# Altium schematic sheet AVR64DA64-IO.SchDoc
size A4; SheetNumber: 2; SheetTotal: 3
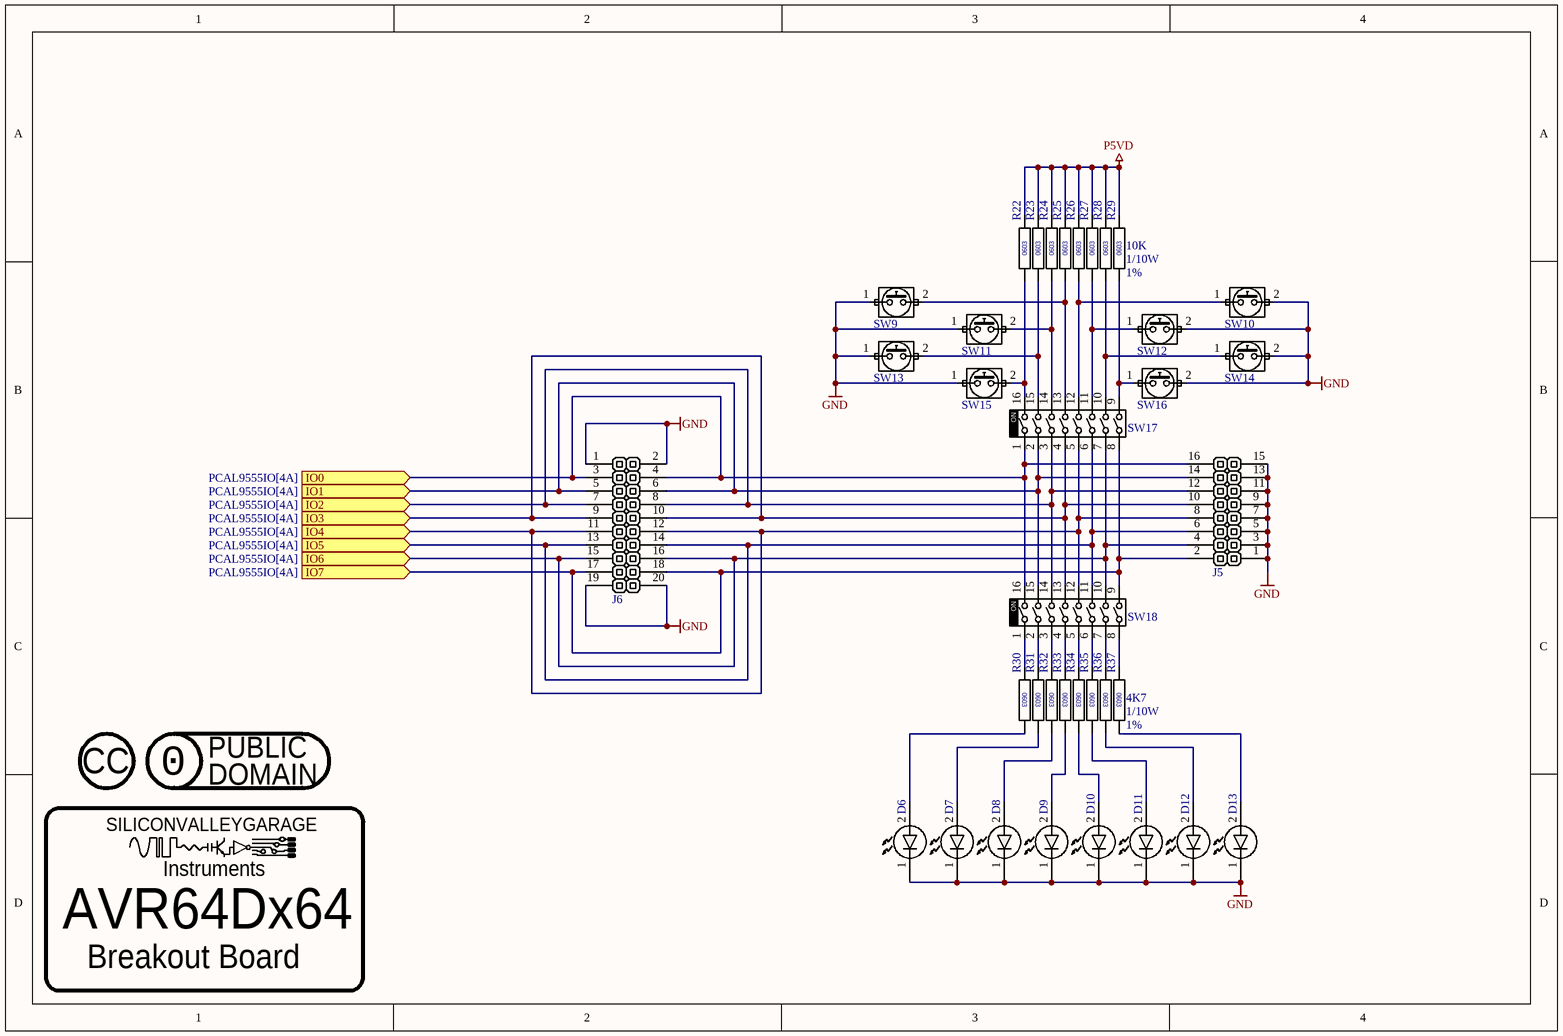
[diagram p0: AVR64DA64-IO.SchDoc]

## Parts
(Parts that share a designator on the sheet are numbered #1, #2 ... from top to bottom, then left to right.)
D6  KT-0603W  [LED-0603-GREEN]  (value not drawn)
D7  KT-0603W  [LED-0603-GREEN]  (value not drawn)
D8  KT-0603W  [LED-0603-GREEN]  (value not drawn)
D9  KT-0603W  [LED-0603-GREEN]  (value not drawn)
D10  KT-0603W  [LED-0603-GREEN]  (value not drawn)
D11  KT-0603W  [LED-0603-GREEN]  (value not drawn)
D12  KT-0603W  [LED-0603-GREEN]  (value not drawn)
D13  KT-0603W  [LED-0603-GREEN]  (value not drawn)
J5  BOXHEADER-3X2  [CONNECTOR-GENERIC-PINHEADER-2X8]  (value not drawn)
J6  BOXHEADER-3X2  [CONNECTOR-GENERIC-PINHEADER-2X10]  (value not drawn)
LOGO?#1  LOGO-LICENSE-CC  [LOGO-LICENSE-CC]  (value not drawn)  (no BOM)
LOGO?#2  LOGO-LICENSE-CC0-PUBLIC  [LOGO-LICENSE-CC0-PUBLIC]  (value not drawn)  (no BOM)
LOGO?#3  LOGO-SILICONVALLEYGARAGE-SMALL  [SILICONVALLEYGARAGE]  (value not drawn)  (graphical)
R22  RESC0603  [RESC0603]  (value not drawn)
R23  RESC0603  [RESC0603]  (value not drawn)
R24  RESC0603  [RESC0603]  (value not drawn)
R25  RESC0603  [RESC0603]  (value not drawn)
R26  RESC0603  [RESC0603]  (value not drawn)
R27  RESC0603  [RESC0603]  (value not drawn)
R28  RESC0603  [RESC0603]  (value not drawn)
R29  value 10K  Power: 1/10W  Tolerance: 1%  [RESC0603]  (hidden comment: RESC0603)
R30  RESC0603  [RESC0603]  (value not drawn)
R31  RESC0603  [RESC0603]  (value not drawn)
R32  RESC0603  [RESC0603]  (value not drawn)
R33  RESC0603  [RESC0603]  (value not drawn)
R34  RESC0603  [RESC0603]  (value not drawn)
R35  RESC0603  [RESC0603]  (value not drawn)
R36  RESC0603  [RESC0603]  (value not drawn)
R37  value 4K7  Power: 1/10W  Tolerance: 1%  [RESC0603]  (hidden comment: RESC0603)
SW9  SWITCH-XUNPU-TS-1088-AR02016  [SWITCH-XUNPU-TS-1088-AR02016]  (value not drawn)
SW10  SWITCH-XUNPU-TS-1088-AR02016  [SWITCH-XUNPU-TS-1088-AR02016]  (value not drawn)
SW11  SWITCH-XUNPU-TS-1088-AR02016  [SWITCH-XUNPU-TS-1088-AR02016]  (value not drawn)
SW12  SWITCH-XUNPU-TS-1088-AR02016  [SWITCH-XUNPU-TS-1088-AR02016]  (value not drawn)
SW13  SWITCH-XUNPU-TS-1088-AR02016  [SWITCH-XUNPU-TS-1088-AR02016]  (value not drawn)
SW14  SWITCH-XUNPU-TS-1088-AR02016  [SWITCH-XUNPU-TS-1088-AR02016]  (value not drawn)
SW15  SWITCH-XUNPU-TS-1088-AR02016  [SWITCH-XUNPU-TS-1088-AR02016]  (value not drawn)
SW16  SWITCH-XUNPU-TS-1088-AR02016  [SWITCH-XUNPU-TS-1088-AR02016]  (value not drawn)
SW17  SWITCH-DIP-NOX8-SMT-2.54  [SWITCH-CTS-219-8MST]  (value not drawn)
SW18  SWITCH-DIP-NOX8-SMT-2.54  [SWITCH-CTS-219-8MST]  (value not drawn)

## Blocks framed on the sheet
AVR64Dx64: LOGO?#3

## Ports
IO0 (in, see PCAL9555IO[4A]), IO1 (in, see PCAL9555IO[4A]), IO2 (in, see PCAL9555IO[4A]), IO3 (in, see PCAL9555IO[4A]), IO4 (in, see PCAL9555IO[4A]), IO5 (in, see PCAL9555IO[4A]), IO6 (in, see PCAL9555IO[4A]), IO7 (in, see PCAL9555IO[4A])

## Nets
GND: D6.1(A) D7.1(A) D8.1(A) D9.1(A) D10.1(A) D11.1(A) D12.1(A) D13.1(A) J5.1(+) J5.3(-) J5.5(-) J5.7(-) J5.9(-) J5.11(-) J5.13(-) J5.15(-) J6.1(+) J6.2(-) J6.19(-) J6.20(-) SW9.1 SW10.2 SW11.1 SW12.2 SW13.1 SW14.2 SW15.1 SW16.2
P5VD: R22.1 R23.1 R24.1 R25.1 R26.1 R27.1 R28.1 R29.1
IO0: J5.16(-) J6.3(-) J6.4(-) SW17.1 SW18.16 ; port IO0
IO1: J5.14(-) J6.5(-) J6.6(-) SW17.2 SW18.15 ; port IO1
IO2: J5.12(-) J6.7(-) J6.8(-) SW17.3 SW18.14 ; port IO2
IO3: J5.10(-) J6.9(-) J6.10(-) SW17.4 SW18.13 ; port IO3
IO4: J5.8(-) J6.11(-) J6.12(-) SW17.5 SW18.12 ; port IO4
IO5: J5.6(-) J6.13(-) J6.14(-) SW17.6 SW18.11 ; port IO5
IO6: J5.4(-) J6.15(-) J6.16(-) SW17.7 SW18.10 ; port IO6
IO7: J5.2(-) J6.17(-) J6.18(-) SW17.8 SW18.9 ; port IO7
NetD6_2: D6.2(K) R30.1
NetD7_2: D7.2(K) R31.1
NetD8_2: D8.2(K) R32.1
NetD9_2: D9.2(K) R33.1
NetD10_2: D10.2(K) R34.1
NetD11_2: D11.2(K) R35.1
NetD12_2: D12.2(K) R36.1
NetD13_2: D13.2(K) R37.1
NetR22_2: R22.2 SW15.2 SW17.16
NetR23_2: R23.2 SW13.2 SW17.15
NetR24_2: R24.2 SW11.2 SW17.14
NetR25_2: R25.2 SW9.2 SW17.13
NetR26_2: R26.2 SW10.1 SW17.12
NetR27_2: R27.2 SW12.1 SW17.11
NetR28_2: R28.2 SW14.1 SW17.10
NetR29_2: R29.2 SW16.1 SW17.9
NetR30_2: R30.2 SW18.1
NetR31_2: R31.2 SW18.2
NetR32_2: R32.2 SW18.3
NetR33_2: R33.2 SW18.4
NetR34_2: R34.2 SW18.5
NetR35_2: R35.2 SW18.6
NetR36_2: R36.2 SW18.7
NetR37_2: R37.2 SW18.8

## Notes on the sheet
- (near LOGO?#3) Instruments
- Breakout Board
- (in symbol LOGO-LICENSE-CC) CC
- (in symbol LOGO-LICENSE-CC0-PUBLIC) PUBLIC; 0; DOMAIN
- (in symbol LOGO-SILICONVALLEYGARAGE-SMALL) SILICONVALLEYGARAGE
- (in symbol RESC-0603-4K7-1%-1/10W) 0603
- (in symbol RESC-0603-10K-1%-1/10W) 0603
- (in symbol SWITCH-DIP-NOX8-SMT-2.54) ON

## Library data of the parts
D6-D13 = LED-0603-WHITE: LED,SMD,WHITE,42mCd,0603; Manufacturer 1: Hubei KENTO Elec; LCSC: C2290; Manufacturer Part Number 1: KT-0603W
J5 = CONN-HEADER-MALE-2X8: CONN,HEADER,2X8,2.54mm; LCSC: C42431826
J6 = CONN-HEADER-MALE-2X10: CONN,HEADER,2X10,2.54mm; LCSC: C5383109
LOGO?#3 = LOGO-SILICONVALLEYGARAGE-SMALL: LOGO,SILICONVALLEYGARAGE,SMALL
R22-R28 = RESC-0603-10K-1%-1/10W: RESISTOR,10K,1%,100mW,0603 (1608); Manufacturer 1: YAGEO; Manufacturer Part Number 1: RC0603FR-0710KL; Power: 1/10W; Location: *; LCSC: C25804; MOUSER: 603-RC0603FR-0710KL; Tolerance: 1%; Value: 10K
R29 = RESC-0603-10K-1%-1/10W: RESISTOR,10K,1%,100mW,0603 (1608); Manufacturer 1: YAGEO; Manufacturer Part Number 1: RC0603FR-0710KL; Location: *; LCSC: C25804; MOUSER: 603-RC0603FR-0710KL
R30-R36 = RESC-0603-4K7-1%-1/10W: RESISTOR,4K7,1%,100mW,0603 (1608); Manufacturer 1: YAGEO; Manufacturer Part Number 1: RC0603FR-074K7L; Power: 1/10W; Location: *; LCSC: C23162; MOUSER: 603-RC0603FR-074K7L; Tolerance: 1%; Value: 4K7
R37 = RESC-0603-4K7-1%-1/10W: RESISTOR,4K7,1%,100mW,0603 (1608); Manufacturer 1: YAGEO; Manufacturer Part Number 1: RC0603FR-074K7L; Location: *; LCSC: C23162; MOUSER: 603-RC0603FR-074K7L
SW9-SW16 = SWITCH-XUNPU-TS-1088-AR02016: SWITCH,TACT,SMD,2PIN,SMT,TOP ACTUATOR; Manufacturer 1: XUNPU; LCSC: C720477; Manufacturer Part Number 1: TS-1088-AR02016
SW17 SW18 = SWITCH-DIP-NOX8-SMT-2.54: SWITCH,DIP,NOX8,SMD,2.54; Manufacturer 1: HanElectricity; Manufacturer Part Number 1: HY-DSIC08LS; LCSC: C319032